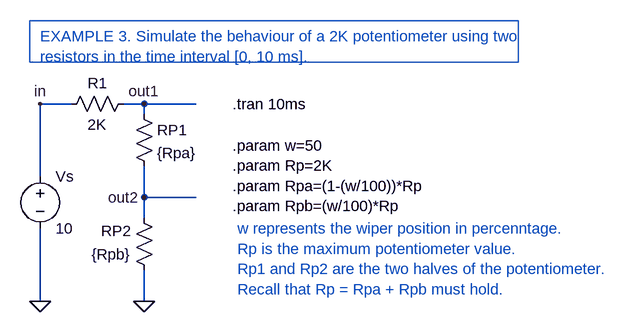
[diagram p0: schematic example-003.asc]
example-003.asc, the LTspice schematic file:
Version 4
SHEET 1 1472 680
WIRE 192 128 144 128
WIRE 304 128 272 128
WIRE 384 128 304 128
WIRE 304 144 304 128
WIRE 144 240 144 128
WIRE 304 272 304 224
WIRE 384 272 304 272
WIRE 304 304 304 272
WIRE 144 432 144 320
WIRE 304 432 304 384
FLAG 304 432 0
FLAG 144 432 0
FLAG 144 128 in
FLAG 304 272 out2
FLAG 304 128 out1
SYMBOL voltage 144 224 R0
SYMATTR InstName Vs
SYMATTR Value 10
SYMBOL Res 320 400 R180
WINDOW 0 36 76 Left 2
WINDOW 3 36 40 Left 2
SYMATTR InstName RP2
SYMATTR Value {Rpb}
SYMBOL Res 288 128 R0
SYMATTR InstName RP1
SYMATTR Value {Rpa}
SYMBOL Res 288 112 R90
WINDOW 0 0 56 VBottom 2
WINDOW 3 32 56 VTop 2
SYMATTR InstName R1
SYMATTR Value 2K
TEXT 144 24 Left 2 ;EXAMPLE 3. Simulate the behaviour of a 2K potentiometer using two\nresistors in the time interval [0, 10 ms].
TEXT 440 128 Left 2 !.tran 10ms
TEXT 440 192 Left 2 !.param w=50\n.param Rp=2K\n.param Rpa=(1-(w/100))*Rp\n.param Rpb=(w/100)*Rp
TEXT 448 320 Left 2 ;w represents the wiper position in percenntage.\nRp is the maximum potentiometer value.\nRp1 and Rp2 are the two halves of the potentiometer.\nRecall that Rp = Rpa + Rpb must hold.
RECTANGLE Normal 128 0 880 64

The netlist it stands for:
* example-003.asc
Vs in 0 10
RP2 0 out2 {Rpb}
RP1 out1 out2 {Rpa}
R1 out1 in 2K
* EXAMPLE 3. Simulate the behaviour of a 2K potentiometer using two
* resistors in the time interval [0, 10 ms].
.tran 10ms
.param w=50
.param Rp=2K
.param Rpa=(1-(w/100))*Rp
.param Rpb=(w/100)*Rp
* w represents the wiper position in percenntage.
* Rp is the maximum potentiometer value.
* Rp1 and Rp2 are the two halves of the potentiometer.
* Recall that Rp = Rpa + Rpb must hold.
.backanno
.end